# Altium project CPUboard.PrjPcb
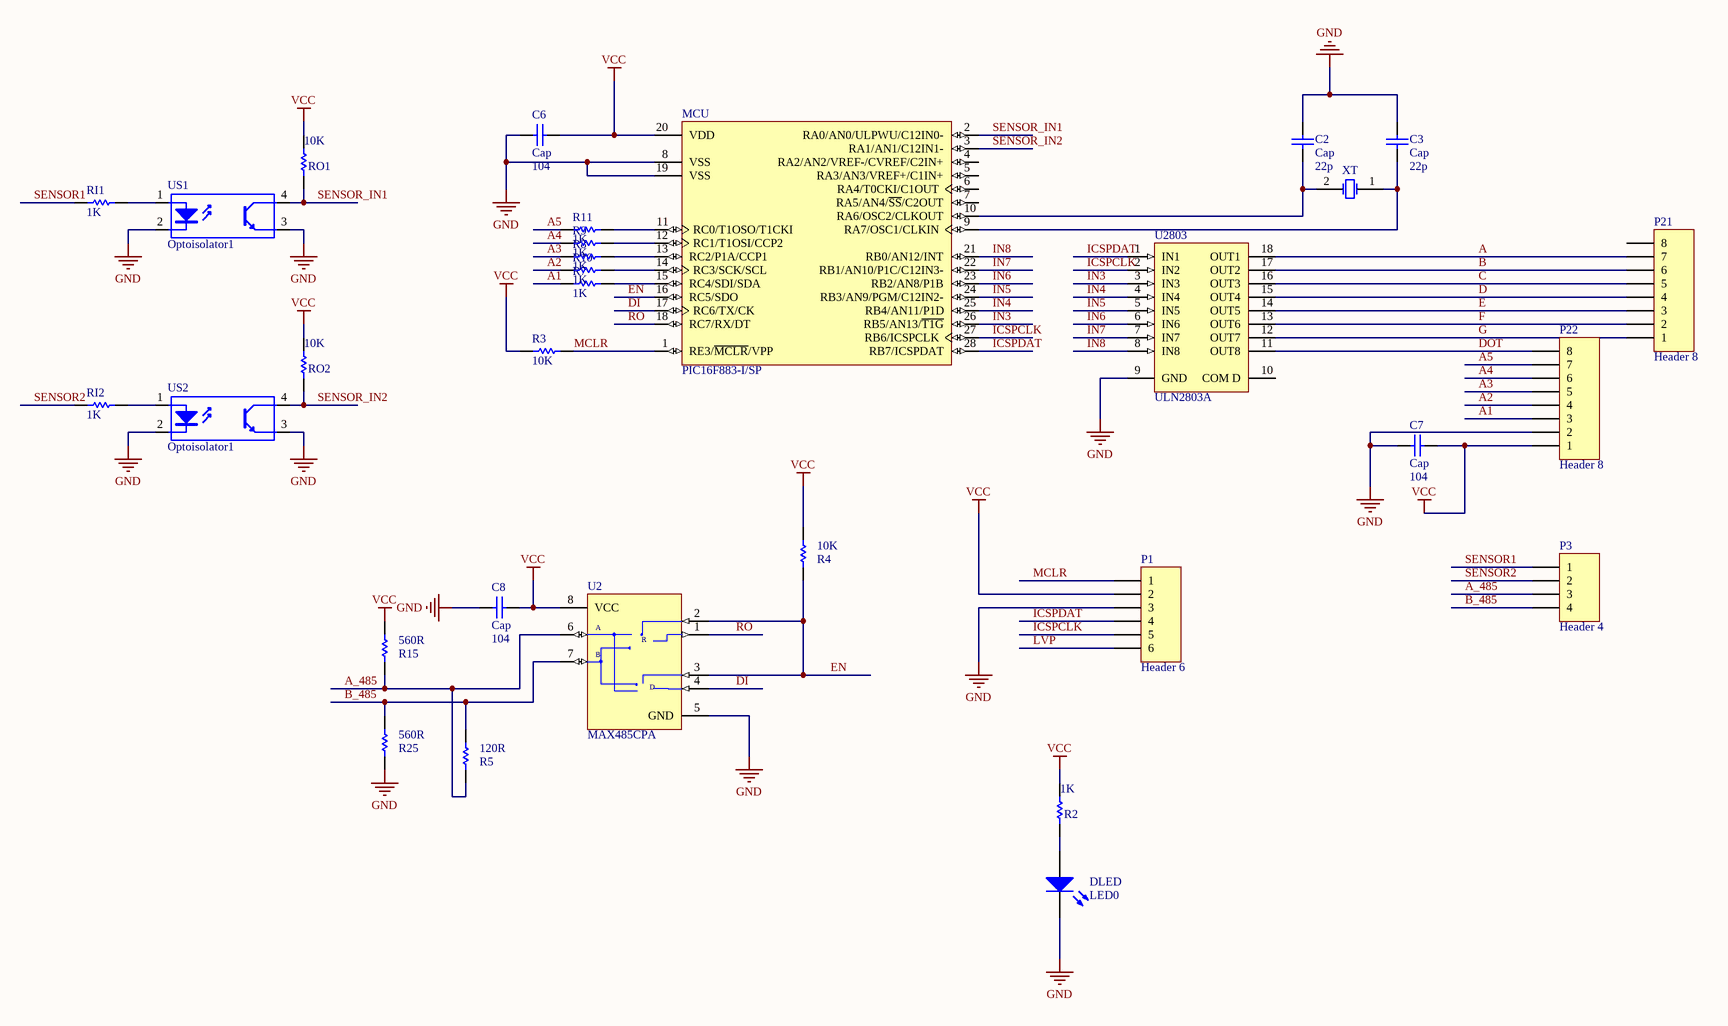
[diagram p0: CPUboard.SchDoc]
2 sheets, 61 parts. Net scope: global (net labels, ports and power ports of the same name join across sheets).
Board file: CPUboard.PcbDoc
Sheets:
  CPUboard.SchDoc
  mach_koLED.SchDoc

## Sheet CPUboard.SchDoc
size A2

### Parts
(Parts that share a designator on the sheet are numbered #1, #2 ... from top to bottom, then left to right.)
C2#1  Cap  value 22p  [tu_gom]
C3#1  Cap  value 22p  [tu_gom]
C6#1  Cap  value 104  [tu_gom]
C7  Cap  value 104  [tu_gom]
C8#1  Cap  value 104  [tu_gom]
DLED#1  LED0  [LED_3]
MCU#1  PIC16F883-I/SP  [SPDIP300-SP28]
P1  Header 6  [HDR1X6]
P3  Header 4  [CAP 4]
P21  Header 8  [Cap_8]
P22  Header 8  [Cap_8]
R2#1  1K  [R_Nor]
R3#1  10K  [R_Nor]
R4  10K  [R_Nor]
R5  120R  [R_Nor]
R7  1K  [R_Nor]
R8  1K  [R_Nor]
R9  1K  [R_Nor]
R10  1K  [R_Nor]
R11  1K  [R_Nor]
R15  560R  [R_Nor]
R25  560R  [R_Nor]
RI1#1  1K  [R_Nor]
RI2#1  1K  [R_Nor]
RO1#1  10K  [R_Nor]
RO2#1  10K  [R_Nor]
U2#1  MAX485CPA  [PA8]
U2803  ULN2803A  [DIP18]
US1#1  Optoisolator1  [Opto]
US2#1  Optoisolator1  [Opto]
XT#1  XTAL  [Xtal12M]  (value not drawn)

### Nets
GND: C2#1.2 C3#1.2 C6#1.2 C7.1 C8#1.1 DLED#1.2(K) MCU#1.8(VSS) MCU#1.19(VSS) P1.3 P22.2 R25.1 U2#1.5(GND) U2803.9(GND) US1#1.2(K) US1#1.3(E) US2#1.2(K) US2#1.3(E)
VCC: C6#1.1 C7.2 C8#1.2 MCU#1.20(VDD) P1.2 P22.1 R2#1.2 R3#1.2 R4.2 R15.2 RO1#1.2 RO2#1.2 U2#1.8(VCC)
A: P21.7 U2803.18(OUT1)
A1: P22.3 R7.2
A2: P22.4 R10.2
A3: P22.5 R8.2
A4: P22.6 R9.2
A5: P22.7 R11.2
A_485: P3.3 R5.1 R15.1 U2#1.6(A)
B: P21.6 U2803.17(OUT2)
B_485: P3.4 R5.2 R25.2 U2#1.7(B)
C: P21.5 U2803.16(OUT3)
D: P21.4 U2803.15(OUT4)
DI: MCU#1.17(RC6/TX/CK) U2#1.4(DI)
DOT: P22.8 U2803.11(OUT8)
E: P21.3 U2803.14(OUT5)
EN: MCU#1.16(RC5/SDO) R4.1 U2#1.2(~{RE}) U2#1.3(DE)
F: P21.2 U2803.13(OUT6)
G: P21.1 U2803.12(OUT7)
ICSPCLK: MCU#1.27(RB6/ICSPCLK) P1.5 U2803.2(IN2)
ICSPDAT: MCU#1.28(RB7/ICSPDAT) P1.4 U2803.1(IN1)
IN3: MCU#1.26(RB5/AN13/~{T1G}) U2803.3(IN3)
IN4: MCU#1.25(RB4/AN11/P1D) U2803.4(IN4)
IN5: MCU#1.24(RB3/AN9/PGM/C12IN2-) U2803.5(IN5)
IN6: MCU#1.23(RB2/AN8/P1B) U2803.6(IN6)
IN7: MCU#1.22(RB1/AN10/P1C/C12IN3-) U2803.7(IN7)
IN8: MCU#1.21(RB0/AN12/INT) U2803.8(IN8)
LVP: P1.6
MCLR: MCU#1.1(RE3/~{MCLR}/VPP) P1.1 R3#1.1
RO: MCU#1.18(RC7/RX/DT) U2#1.1(RO)
SENSOR1: P3.1 RI1#1.2
SENSOR2: P3.2 RI2#1.2
SENSOR_IN1: MCU#1.2(RA0/AN0/ULPWU/C12IN0-) RO1#1.1 US1#1.4(C)
SENSOR_IN2: MCU#1.3(RA1/AN1/C12IN1-) RO2#1.1 US2#1.4(C)
NetC2#1_1: C2#1.1 MCU#1.10(RA6/OSC2/CLKOUT) XT#1.2(OSC2)
NetC3#1_1: C3#1.1 MCU#1.9(RA7/OSC1/CLKIN) XT#1.1(OSC1)
NetDLED#1_1: DLED#1.1(A) R2#1.1
NetMCU#1_11: MCU#1.11(RC0/T1OSO/T1CKI) R11.1
NetMCU#1_12: MCU#1.12(RC1/T1OSI/CCP2) R9.1
NetMCU#1_13: MCU#1.13(RC2/P1A/CCP1) R8.1
NetMCU#1_14: MCU#1.14(RC3/SCK/SCL) R10.1
NetMCU#1_15: MCU#1.15(RC4/SDI/SDA) R7.1
NetRI1#1_1: RI1#1.1 US1#1.1(A)
NetRI2#1_1: RI2#1.1 US2#1.1(A)

Not connected (* = marked no-connect by the designer): MCU#1 4(RA2/AN2/VREF-/CVREF/C2IN+) 5(RA3/AN3/VREF+/C1IN+) 6(RA4/T0CKI/C1OUT) 7(RA5/AN4/~{SS}/C2OUT); P21 8; U2803 10(COM_D)

### Notes on the sheet
- (in symbol MAX485CPA) R; D

### Library data of the parts
C2#1 C3#1 C6#1 C7 C8#1 = Ceramic: Capcitor
DLED#1 = LED0: Typical INFRARED GaAs LED; Published: 8-Jun-2000; LatestRevisionDate: 08-Jul-2005; LatestRevisionNote: Mech Layer 1 removed.; PackageReference: LED-0; Publisher: Altium Limited
MCU#1 = PIC16F883-I/SP: Flash-Based, 8-Bit CMOS Microcontroller with nanoWatt Technology, 4K (x14-Bit words) Program Memory, 512 Bytes Data Memory, 24 I/O pins, 28-Pin SPDIP, Standard VDD Range, Industrial Temperature; FirstPublished: 29-Jan-2009; LatestRevisionDate: 02-Dec-2009; LatestRevisionNote: Updated datasheet to version revF, Apr-2009.; DatasheetVersion: revF, Apr-2009; PackageVersion: revBB, Aug-2009; PackageReference: SPDIP300-SP28; Publisher: Altium Limited; PackageDescription: 28-Lead Skinny Plastic Dual In-Line (SP) - 300 mil Body [SPDIP]; Supplier 1: Digi-Key; Supplier Part Number 1: PIC16F883-I/SP-ND; Supplier 2: Farnell; Supplier Part Number 2: 1439533; Supplier 3: Newark; Supplier Part Number 3: 74K8558; ComponentLink1Description: Datasheet; ComponentLink1URL: http://ww1.microchip.com/downloads/en/DeviceDoc/41291F.pdf; ComponentLink2Description: Packaging Specification; ComponentLink2URL: http://www.microchip.com/stellent/groups/techpub_sg/documents/packagingspec/en012702.pdf; ComponentLink3Description: Microchip.com Home; ComponentLink3URL: http://www.microchip.com/
P1 = Header 6: Header, 6-Pin; LatestRevisionDate: 17-Jul-2002; LatestRevisionNote: Re-released for DXP Platform.; Publisher: Altium Limited
P3 = Header 4: Header, 4-Pin; LatestRevisionDate: 17-Jul-2002; LatestRevisionNote: Re-released for DXP Platform.; Publisher: Altium Limited
P21 P22 = Header 8: Header, 8-Pin; LatestRevisionDate: 17-Jul-2002; LatestRevisionNote: Re-released for DXP Platform.; Publisher: Altium Limited
R2#1 R3#1 R4 R5 R7-R11 R15 R25 RI1#1 RI2#1 RO1#1 RO2#1 = Res
U2#1 = MAX485CPA: Low-Power, Slew-Rate-Limited RS-485/RS-422 Transceiver; Published: 16-Jan-2001; LatestRevisionDate: 29-May-2009; LatestRevisionNote: Component Body Added.; DatasheetVersion: Feb-1996; PackageVersion: RevB, 21-0043; PackageReference: PA8; Publisher: Altium Limited; PackageDescription: DIP, 8-Pin, Row Spacing 7.62 mm, Pitch 2.54 mm; Code_JEDEC: MS-001-AB; ComponentLink1Description: Manufacturer Link; ComponentLink1URL: http://www.maxim-ic.com/; ComponentLink2Description: Datasheet; ComponentLink2URL: http://pdfserv.maxim-ic.com/en/ds/MAX1487-MAX491.pdf
U2803 = ULN2803A: Eight Darlington Array; Published: 8-Jun-2000; LatestRevisionDate: 06-Jun-2005; LatestRevisionNote: Stylized 3D Model Added.; DatasheetVersion: Sep-1997; PackageReference: DIP18; Publisher: Altium Limited; PackageDescription: DIP; 18 Leads; Row Spacing 7.62 mm; Pitch 2.54 mm; ComponentLink1Description: Manufacturer Link; ComponentLink1URL: http://www.st.com/; ComponentLink2Description: Datasheet; ComponentLink2URL: http://www.st.com/stonline/products/literature/ds/1536/uln2801a.pdf
US1#1 US2#1 = Optoisolator1: 4-Pin Phototransistor Optocoupler; Published: 24-Mar-1999; LatestRevisionDate: 04-Mar-2005; LatestRevisionNote: Sch pins 3 & 4 Swapped.; DatasheetVersion: Nov-2003; PackageReference: DIP-4; Publisher: Altium Limited
XT#1 = XTAL: Crystal Oscillator; Published: 8-Jun-2000; LatestRevisionDate: 17-Jul-2002; LatestRevisionNote: Re-released for DXP Platform.; PackageReference: R38; Publisher: Altium Limited

## Sheet mach_koLED.SchDoc
size A2
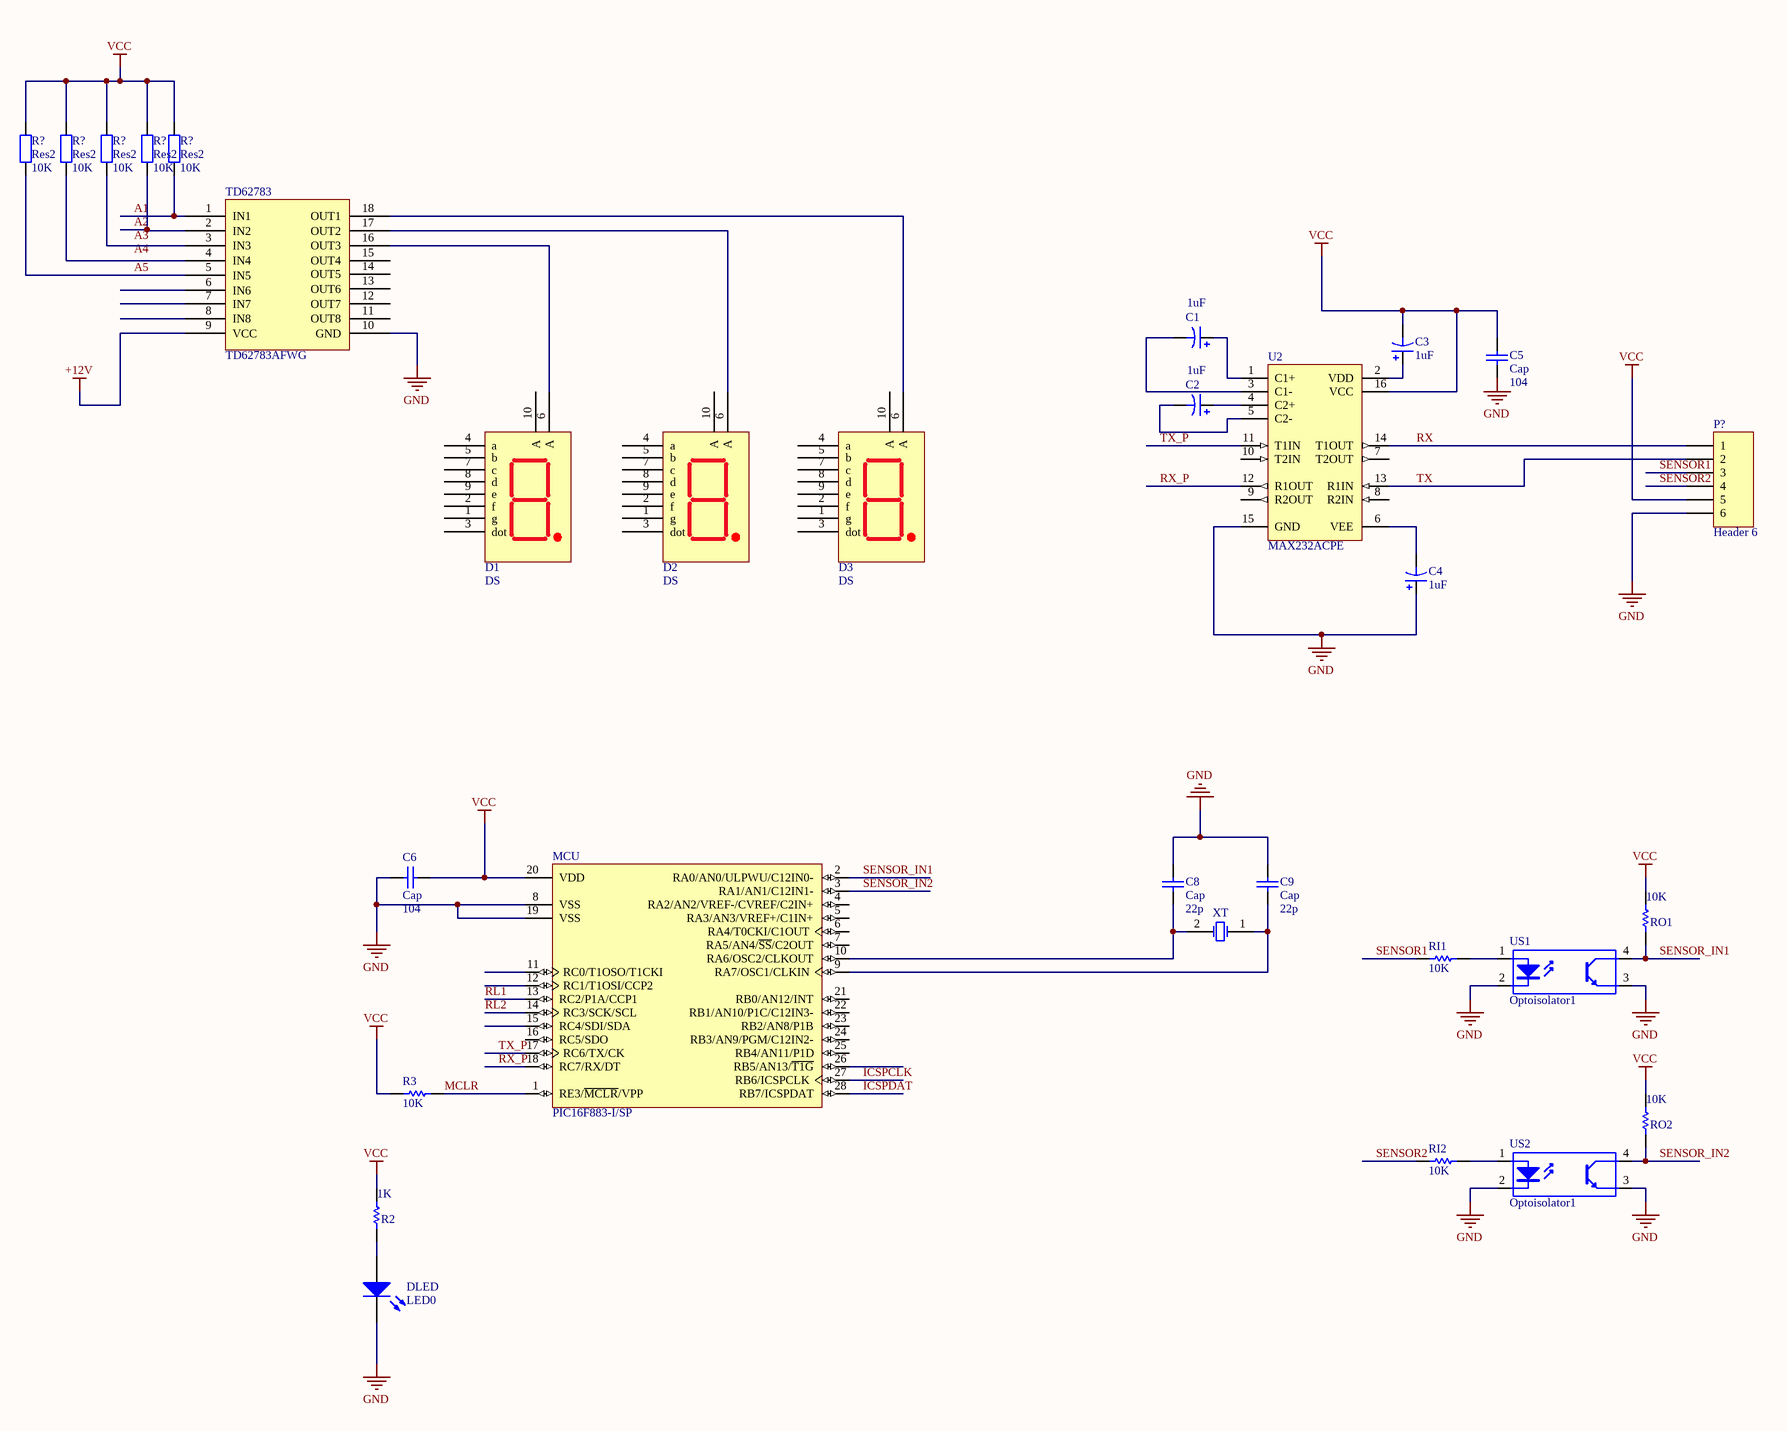
[diagram p1: mach_koLED.SchDoc]

### Parts
(Parts that share a designator on the sheet are numbered #1, #2 ... from top to bottom, then left to right.)
C1  value 1uF  [tu 10uF]  (hidden comment: Cap Pol1)
C2#2  value 1uF  [tu 10uF]  (hidden comment: Cap Pol1)
C3#2  value 1uF  [tu 10uF]  (hidden comment: Cap Pol1)
C4  value 1uF  [tu 10uF]  (hidden comment: Cap Pol1)
C5  Cap  value 104  [tu_gom]
C6#2  Cap  value 104  [tu_gom]
C8#2  Cap  value 22p  [tu_gom]
C9  Cap  value 22p  [tu_gom]
D1  DS  [7SEG_1DIGIT_305x44]
D2  DS  [7SEG_1DIGIT_305x44]
D3  DS  [7SEG_1DIGIT_305x44]
DLED#2  LED0  [LED_3]
MCU#2  PIC16F883-I/SP  [SPDIP300-SP28]
P?  Header 6  [HDR1X6]
R2#2  1K  [R_Nor]
R3#2  10K  [R_Nor]
R?#1  Res2  value 10K  [AXIAL-0.4]
R?#2  Res2  value 10K  [AXIAL-0.4]
R?#3  Res2  value 10K  [AXIAL-0.4]
R?#4  Res2  value 10K  [AXIAL-0.4]
R?#5  Res2  value 10K  [AXIAL-0.4]
RI1#2  10K  [R_Nor]
RI2#2  10K  [R_Nor]
RO1#2  10K  [R_Nor]
RO2#2  10K  [R_Nor]
TD62783  TD62783AFWG
U2#2  MAX232ACPE  [PE16A]
US1#2  Optoisolator1  [Opto]
US2#2  Optoisolator1  [Opto]
XT#2  XTAL  [Xtal12M]  (value not drawn)

### Nets
+12V: TD62783.9(VCC)
GND: C4.1 C5.1 C6#2.2 C8#2.2 C9.2 DLED#2.2(K) MCU#2.8(VSS) MCU#2.19(VSS) P?.6 TD62783.10(GND) U2#2.15(GND) US1#2.2(K) US1#2.3(E) US2#2.2(K) US2#2.3(E)
VCC: C3#2.2 C5.2 C6#2.1 MCU#2.20(VDD) P?.5 R2#2.2 R3#2.2 R?#1.2 R?#2.2 R?#3.2 R?#4.2 R?#5.2 RO1#2.2 RO2#2.2 U2#2.16(VCC)
A1: R?#5.1 TD62783.1(IN1)
A2: R?#4.1 TD62783.2(IN2)
A5: R?#1.1 TD62783.5(IN5)
ICSPCLK: MCU#2.27(RB6/ICSPCLK)
ICSPDAT: MCU#2.28(RB7/ICSPDAT)
MCLR: MCU#2.1(RE3/~{MCLR}/VPP) R3#2.1
RL1: MCU#2.13(RC2/P1A/CCP1)
RL2: MCU#2.14(RC3/SCK/SCL)
RX: P?.1 U2#2.14(T1OUT)
RX_P: MCU#2.18(RC7/RX/DT) U2#2.12(R1OUT)
SENSOR1: P?.3 RI1#2.2
SENSOR2: P?.4 RI2#2.2
SENSOR_IN1: MCU#2.2(RA0/AN0/ULPWU/C12IN0-) RO1#2.1 US1#2.4(C)
SENSOR_IN2: MCU#2.3(RA1/AN1/C12IN1-) RO2#2.1 US2#2.4(C)
TX: P?.2 U2#2.13(R1IN)
TX_P: MCU#2.17(RC6/TX/CK) U2#2.11(T1IN)
NetC1_1: C1.1 U2#2.1(C1+)
NetC1_2: C1.2 U2#2.3(C1-)
NetC2#2_1: C2#2.1 U2#2.4(C2+)
NetC2#2_2: C2#2.2 U2#2.5(C2-)
NetC3#2_1: C3#2.1 U2#2.2(VDD)
NetC4_2: C4.2 U2#2.6(VEE)
NetC8#2_1: C8#2.1 MCU#2.10(RA6/OSC2/CLKOUT) XT#2.2(OSC2)
NetC9_1: C9.1 MCU#2.9(RA7/OSC1/CLKIN) XT#2.1(OSC1)
NetD1_6: D1.6(A) TD62783.16(OUT3)
NetD2_6: D2.6(A) TD62783.17(OUT2)
NetD3_6: D3.6(A) TD62783.18(OUT1)
NetDLED#2_1: DLED#2.1(A) R2#2.1
NetR?#2_1: R?#2.1 TD62783.4(IN4)
NetR?#3_1: R?#3.1 TD62783.3(IN3)
NetRI1#2_1: RI1#2.1 US1#2.1(A)
NetRI2#2_1: RI2#2.1 US2#2.1(A)

Not connected (* = marked no-connect by the designer): D1 1(g) 2(f) 3(dot) 4(a) 5(b) 7(c) 8(d) 9(e) 10(A); D2 1(g) 2(f) 3(dot) 4(a) 5(b) 7(c) 8(d) 9(e) 10(A); D3 1(g) 2(f) 3(dot) 4(a) 5(b) 7(c) 8(d) 9(e) 10(A); MCU#2 4(RA2/AN2/VREF-/CVREF/C2IN+) 5(RA3/AN3/VREF+/C1IN+) 6(RA4/T0CKI/C1OUT) 7(RA5/AN4/~{SS}/C2OUT) 11(RC0/T1OSO/T1CKI) 12(RC1/T1OSI/CCP2) 15(RC4/SDI/SDA) 16(RC5/SDO) 21(RB0/AN12/INT) 22(RB1/AN10/P1C/C12IN3-) 23(RB2/AN8/P1B) 24(RB3/AN9/PGM/C12IN2-) 25(RB4/AN11/P1D) 26(RB5/AN13/~{T1G}); TD62783 6(IN6) 7(IN7) 8(IN8) 11(OUT8) 12(OUT7) 13(OUT6) 14(OUT5) 15(OUT4); U2#2 7(T2OUT) 8(R2IN) 9(R2OUT) 10(T2IN)

### Notes on the sheet
- Labels drawn without touching a wire or pin: A3, A4

### Library data of the parts
C1 C2#2 C3#2 C4 = Cap Pol1: Polarized Capacitor (Radial); Published: 8-Jun-2000; LatestRevisionDate: 17-Jul-2002; LatestRevisionNote: Re-released for DXP Platform.; PackageReference: RB7.6-15; Publisher: Altium Limited
C5 C6#2 C8#2 C9 = Ceramic: Capcitor
D1-D3 = LED_1DIGIT_305x44
DLED#2 = LED0: Typical INFRARED GaAs LED; Published: 8-Jun-2000; LatestRevisionDate: 08-Jul-2005; LatestRevisionNote: Mech Layer 1 removed.; PackageReference: LED-0; Publisher: Altium Limited
MCU#2 = PIC16F883-I/SP: as MCU#1 on sheet CPUboard; FirstPublished: 29-Jan-2009; LatestRevisionDate: 02-Dec-2009; LatestRevisionNote: Updated datasheet to version revF, Apr-2009.; DatasheetVersion: revF, Apr-2009; PackageVersion: revBB, Aug-2009; PackageReference: SPDIP300-SP28; Publisher: Altium Limited; PackageDescription: 28-Lead Skinny Plastic Dual In-Line (SP) - 300 mil Body [SPDIP]; Supplier 1: Digi-Key; Supplier Part Number 1: PIC16F883-I/SP-ND; Supplier 2: Farnell; Supplier Part Number 2: 1439533; Supplier 3: Newark; Supplier Part Number 3: 74K8558; ComponentLink1Description: Datasheet; ComponentLink1URL: http://ww1.microchip.com/downloads/en/DeviceDoc/41291F.pdf; ComponentLink2Description: Packaging Specification; ComponentLink2URL: http://www.microchip.com/stellent/groups/techpub_sg/documents/packagingspec/en012702.pdf; ComponentLink3Description: Microchip.com Home; ComponentLink3URL: http://www.microchip.com/
P? = Header 6: Header, 6-Pin; LatestRevisionDate: 17-Jul-2002; LatestRevisionNote: Re-released for DXP Platform.; Publisher: Altium Limited
R2#2 R3#2 RI1#2 RI2#2 RO1#2 RO2#2 = Res
R?#1-R?#5 = Res2: Resistor; Published: 8-Jun-2000; LatestRevisionDate: 17-Jul-2002; LatestRevisionNote: Re-released for DXP Platform.; PackageReference: AXIAL-0.4; Publisher: Altium Limited
TD62783 = TD62783AG
U2#2 = MAX232ACPE: +5V Powered, Multi-Channel RS-232 Driver/Receiver; Published: 16-Jan-2001; LatestRevisionDate: 29-May-2009; LatestRevisionNote: Component Body Added.; PackageVersion: 1997; PackageReference: PE16A; Publisher: Altium Limited; PackageDescription: DIP, 16-Pin, Row Spacing 7.62 mm, Pitch 2.54 mm; Code_JEDEC: MS-001-BB; ComponentLink1Description: Manufacturer Link; ComponentLink1URL: http://www.maxim-ic.com/; ComponentLink2Description: Datasheet; ComponentLink2URL: http://pdfserv.maxim-ic.com/en/ds/MAX220-MAX249.pdf
US1#2 US2#2 = Optoisolator1: 4-Pin Phototransistor Optocoupler; Published: 24-Mar-1999; LatestRevisionDate: 04-Mar-2005; LatestRevisionNote: Sch pins 3 & 4 Swapped.; DatasheetVersion: Nov-2003; PackageReference: DIP-4; Publisher: Altium Limited
XT#2 = XTAL: Crystal Oscillator; Published: 8-Jun-2000; LatestRevisionDate: 17-Jul-2002; LatestRevisionNote: Re-released for DXP Platform.; PackageReference: R38; Publisher: Altium Limited

## Nets that join several sheets
GND: CPUboard (17 pins), mach_koLED (15 pins)
VCC: CPUboard (13 pins), mach_koLED (15 pins)
A1: CPUboard (P22.3 R7.2), mach_koLED (R?#5.1 TD62783.1)
A2: CPUboard (P22.4 R10.2), mach_koLED (R?#4.1 TD62783.2)
A5: CPUboard (P22.7 R11.2), mach_koLED (R?#1.1 TD62783.5)
ICSPCLK: CPUboard (MCU#1.27 P1.5 U2803.2), mach_koLED (MCU#2.27)
ICSPDAT: CPUboard (MCU#1.28 P1.4 U2803.1), mach_koLED (MCU#2.28)
MCLR: CPUboard (MCU#1.1 P1.1 R3#1.1), mach_koLED (MCU#2.1 R3#2.1)
SENSOR1: CPUboard (P3.1 RI1#1.2), mach_koLED (P?.3 RI1#2.2)
SENSOR2: CPUboard (P3.2 RI2#1.2), mach_koLED (P?.4 RI2#2.2)
SENSOR_IN1: CPUboard (MCU#1.2 RO1#1.1 US1#1.4), mach_koLED (MCU#2.2 RO1#2.1 US1#2.4)
SENSOR_IN2: CPUboard (MCU#1.3 RO2#1.1 US2#1.4), mach_koLED (MCU#2.3 RO2#2.1 US2#2.4)